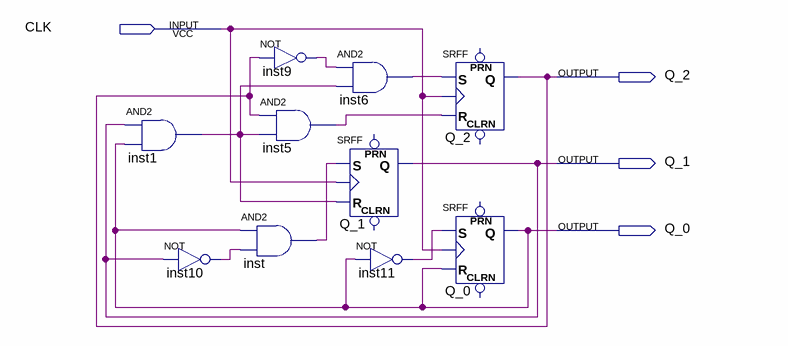
[diagram p0: schematic sheet]
// Quartus schematic hw11p3a.bdf as structural Verilog: 10 symbols, 4 pins
module hw11p3a (
  input  CLK,
  output Q_2,
  output Q_1,
  output Q_0
);

  wire inst1_out, inst5_out, inst6_out, inst9_out, inst10_out, inst11_out, inst_out;

  and inst1 (inst1_out, Q_1, Q_0);
  not inst10 (inst10_out, Q_1);
  not inst9 (inst9_out, Q_2);
  and inst5 (inst5_out, Q_2, inst1_out);
  and inst (inst_out, Q_0, inst10_out);
  and inst6 (inst6_out, inst9_out, inst1_out);
  SRFF u_Q_1 (.S(inst_out), .R(inst1_out), .CLK(CLK), .Q(Q_1));  // open: PRN, CLRN
  not inst11 (inst11_out, Q_0);
  SRFF u_Q_2 (.S(inst6_out), .R(inst5_out), .CLK(CLK), .Q(Q_2));  // open: PRN, CLRN
  SRFF u_Q_0 (.S(inst11_out), .R(Q_0), .CLK(CLK), .Q(Q_0));  // open: PRN, CLRN
endmodule
